# EAGLE schematic calculator_15-Digit (EAGLE 6.6.0)

## Sheet 1 of 4
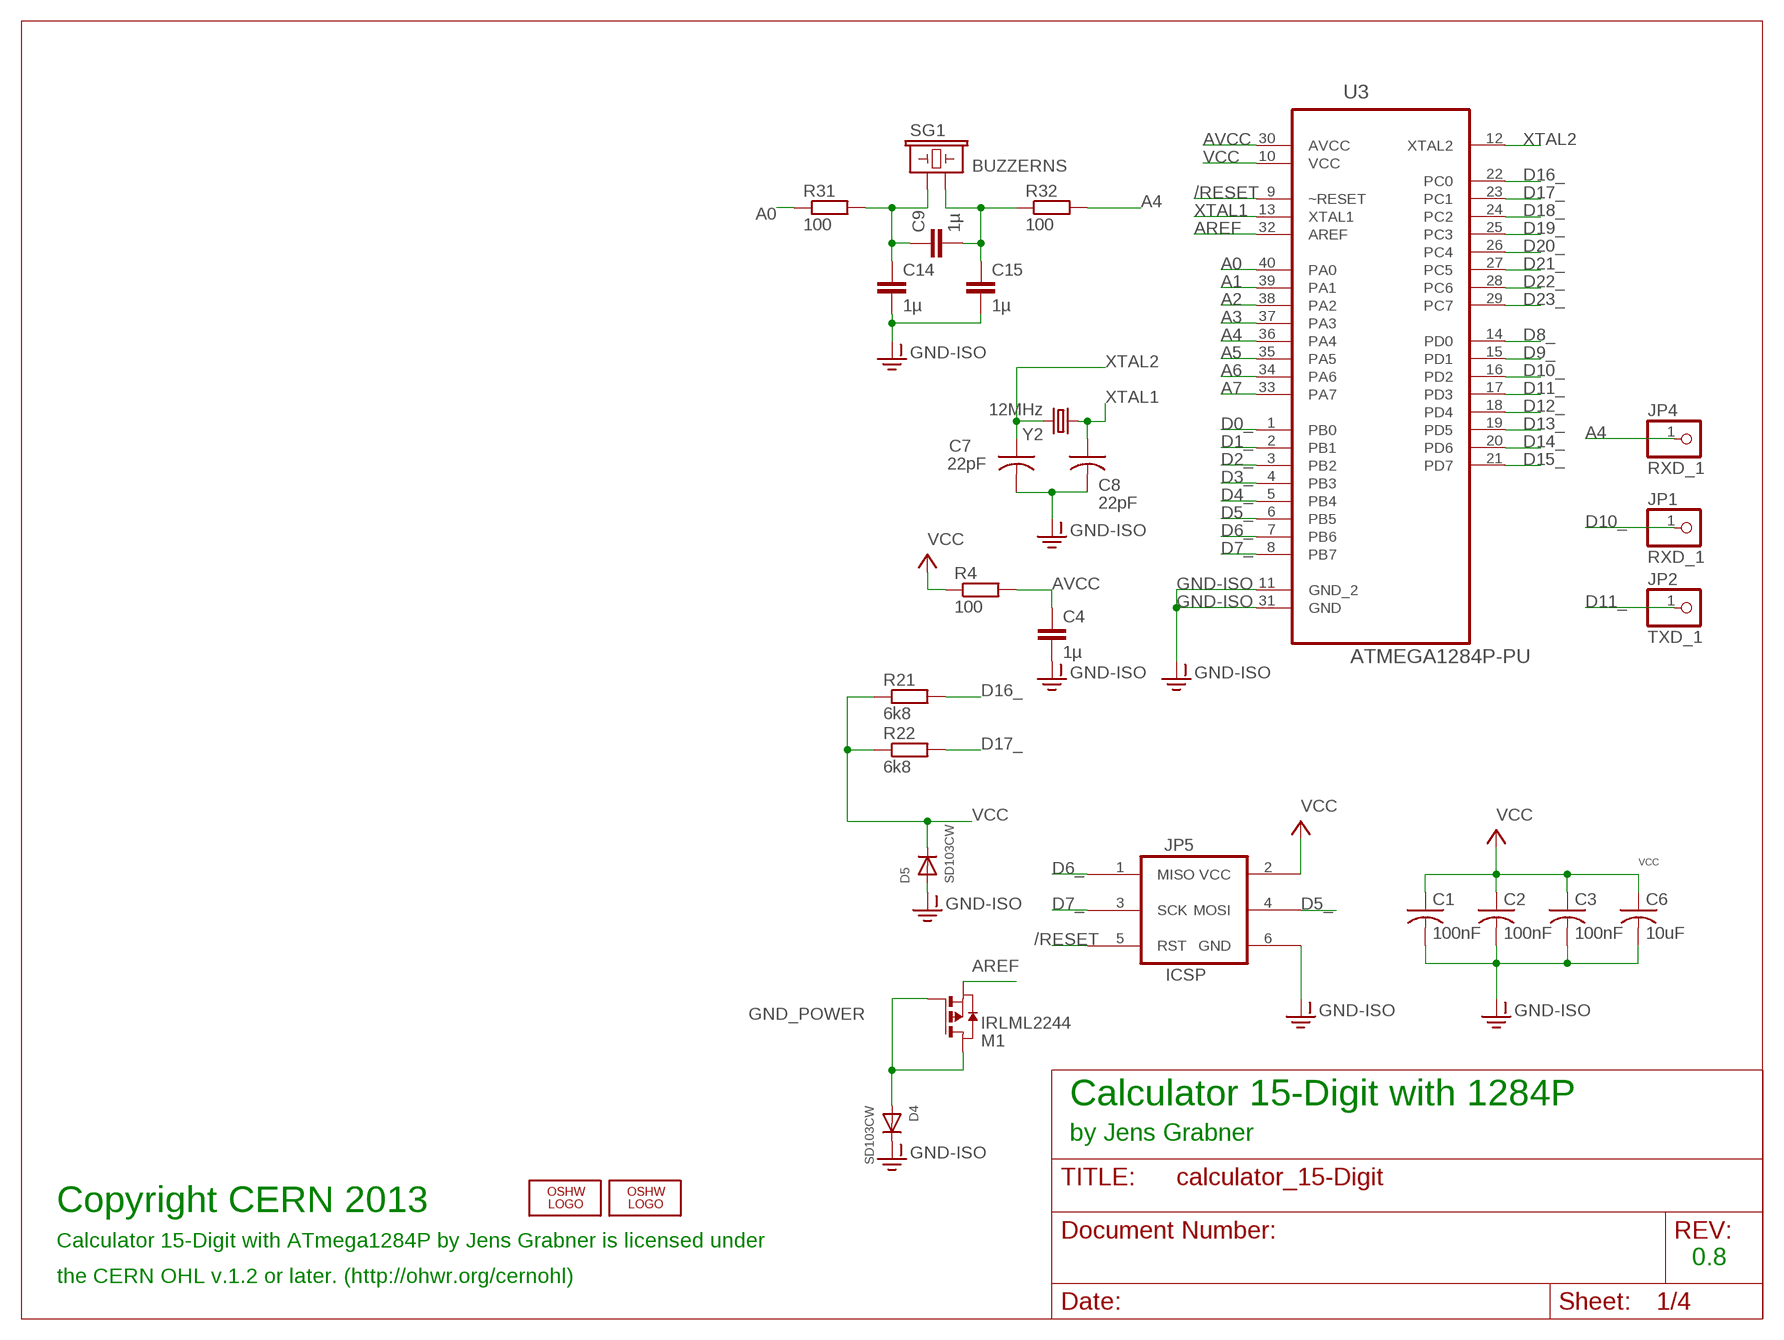
[diagram p0: schematic, sheet 1]

### Parts
C1  100nF  C-US025_050-025X075  [C025_050-025X075]
C2  100nF  C-US025_050-025X075  [C025_050-025X075]
C3  100nF  C-US025_050-025X075  [C025_050-025X075]
C4  1µ  C-EU025_050-025X075  [C025_050-025X075]
C6  10uF  C-US025_050-025X075  [C025_050-025X075]
C7  22pF  C-US025-024X044  [C025-024X044]
C8  22pF  C-US025-024X044  [C025-024X044]
C9  1µ  C-EU025_050-025X075  [C025_050-025X075]
C14  1µ  C-EU025_050-025X075  [C025_050-025X075]
C15  1µ  C-EU025_050-025X075  [C025_050-025X075]
D4  SD103CW  DIODESMA  [SMADIODE]
D5  SD103CW  DIODESMA  [SMADIODE]
JP1  RXD_1  PINHD-1X1CB  [1X01-CLEANBIG]
JP2  TXD_1  PINHD-1X1CB  [1X01-CLEANBIG]
JP4  RXD_1  PINHD-1X1CB  [1X01-CLEANBIG]
JP5  ICSP  AVR_SPI_PRG_62X3_LOCK  [2X3_LOCK]
LOGO1  OSHW_LOGO_8MILX0150-NT  [OSHW_8X150_NOTEXT]
LOGO2  OSHW_LOGO_6MILX0100-NT  [OSHW_6X100_NOTEXT]
M1  IRLML2244  IRLML6402  [SOT-23]
R4  100  R-EU_0204/7  [0204/7]
R21  6k8  R-EU_0204/7  [0204/7]
R22  6k8  R-EU_0204/7  [0204/7]
R31  100  R-EU_0204/7  [0204/7]
R32  100  R-EU_0204/7  [0204/7]
SG1  BUZZERNS  [BUZZER-12MM-NS]
U3  ATMEGA1284P-PU  [DIP254P1524X483-40]
Y2  12MHz  CRYSTALHC49UV  [HC49U-V]

### Nets
/RESET: JP5.5(RST) U3.9(~RESET) ; also sheet 4
A0: R31.1 U3.40(PA0)
A1: U3.39(PA1) ; also sheet 2
A2: U3.38(PA2) ; also sheet 2
A3: U3.37(PA3) ; also sheet 2
A4: JP4.1 R32.2 U3.36(PA4)
A5: U3.35(PA5) ; also sheet 2
A6: U3.34(PA6) ; also sheet 2
A7: U3.33(PA7) ; also sheet 2
AREF: M1.2(S) U3.32(AREF) ; also sheet 4
AVCC: C4.1 R4.2 U3.30(AVCC)
D0_: U3.1(PB0) ; also sheet 3
D1_: U3.2(PB1) ; also sheet 3
D2_: U3.3(PB2)
D3_: U3.4(PB3) ; also sheet 3
D4_: U3.5(PB4)
D5_: JP5.4(MOSI) U3.6(PB5)
D6_: JP5.1(MISO) U3.7(PB6) ; also sheet 3
D7_: JP5.3(SCK) U3.8(PB7) ; also sheet 3
D8_: U3.14(PD0) ; also sheet 4
D9_: U3.15(PD1) ; also sheet 4
D10_: JP1.1 U3.16(PD2) ; also sheet 3
D11_: JP2.1 U3.17(PD3) ; also sheet 3
D12_: U3.18(PD4) ; also sheet 2
D13_: U3.19(PD5) ; also sheet 3
D14_: U3.20(PD6) ; also sheet 3
D15_: U3.21(PD7) ; also sheet 3
D16_: R21.2 U3.22(PC0)
D17_: R22.2 U3.23(PC1)
D18_: U3.24(PC2) ; also sheet 4
D19_: U3.25(PC3) ; also sheet 3
D20_: U3.26(PC4) ; also sheet 3
D21_: U3.27(PC5) ; also sheet 3
D22_: U3.28(PC6) ; also sheet 3
D23_: U3.29(PC7) ; also sheet 3
GND-ISO: C1.2 C2.2 C3.2 C4.2 C6.2 C7.2 C8.2 C14.2 C15.2 D4.C D5.A JP5.6(GND) U3.11(GND_2) U3.31(GND) ; also sheet 2,4
GND_POWER: D4.A M1.1(G) M1.3(D)
N$10: C9.2 C15.1 R32.1 SG1.-
N$23: C9.1 C14.1 R31.2 SG1.+
VCC: C1.1 C2.1 C3.1 C6.1 D5.C JP5.2(VCC) R4.1 R21.1 R22.1 U3.10(VCC) ; also sheet 4
XTAL1: C8.1 U3.13(XTAL1) Y2.1
XTAL2: C7.1 U3.12(XTAL2) Y2.2

### Notes on the sheet
- Calculator 15-Digit with 1284P
- by Jens Grabner
- Copyright CERN 2013
- Calculator 15-Digit with ATmega1284P by Jens Grabner is licensed under
- 0.8
- the CERN OHL v.1.2 or later. (http://ohwr.org/cernohl)

## Sheet 2 of 4
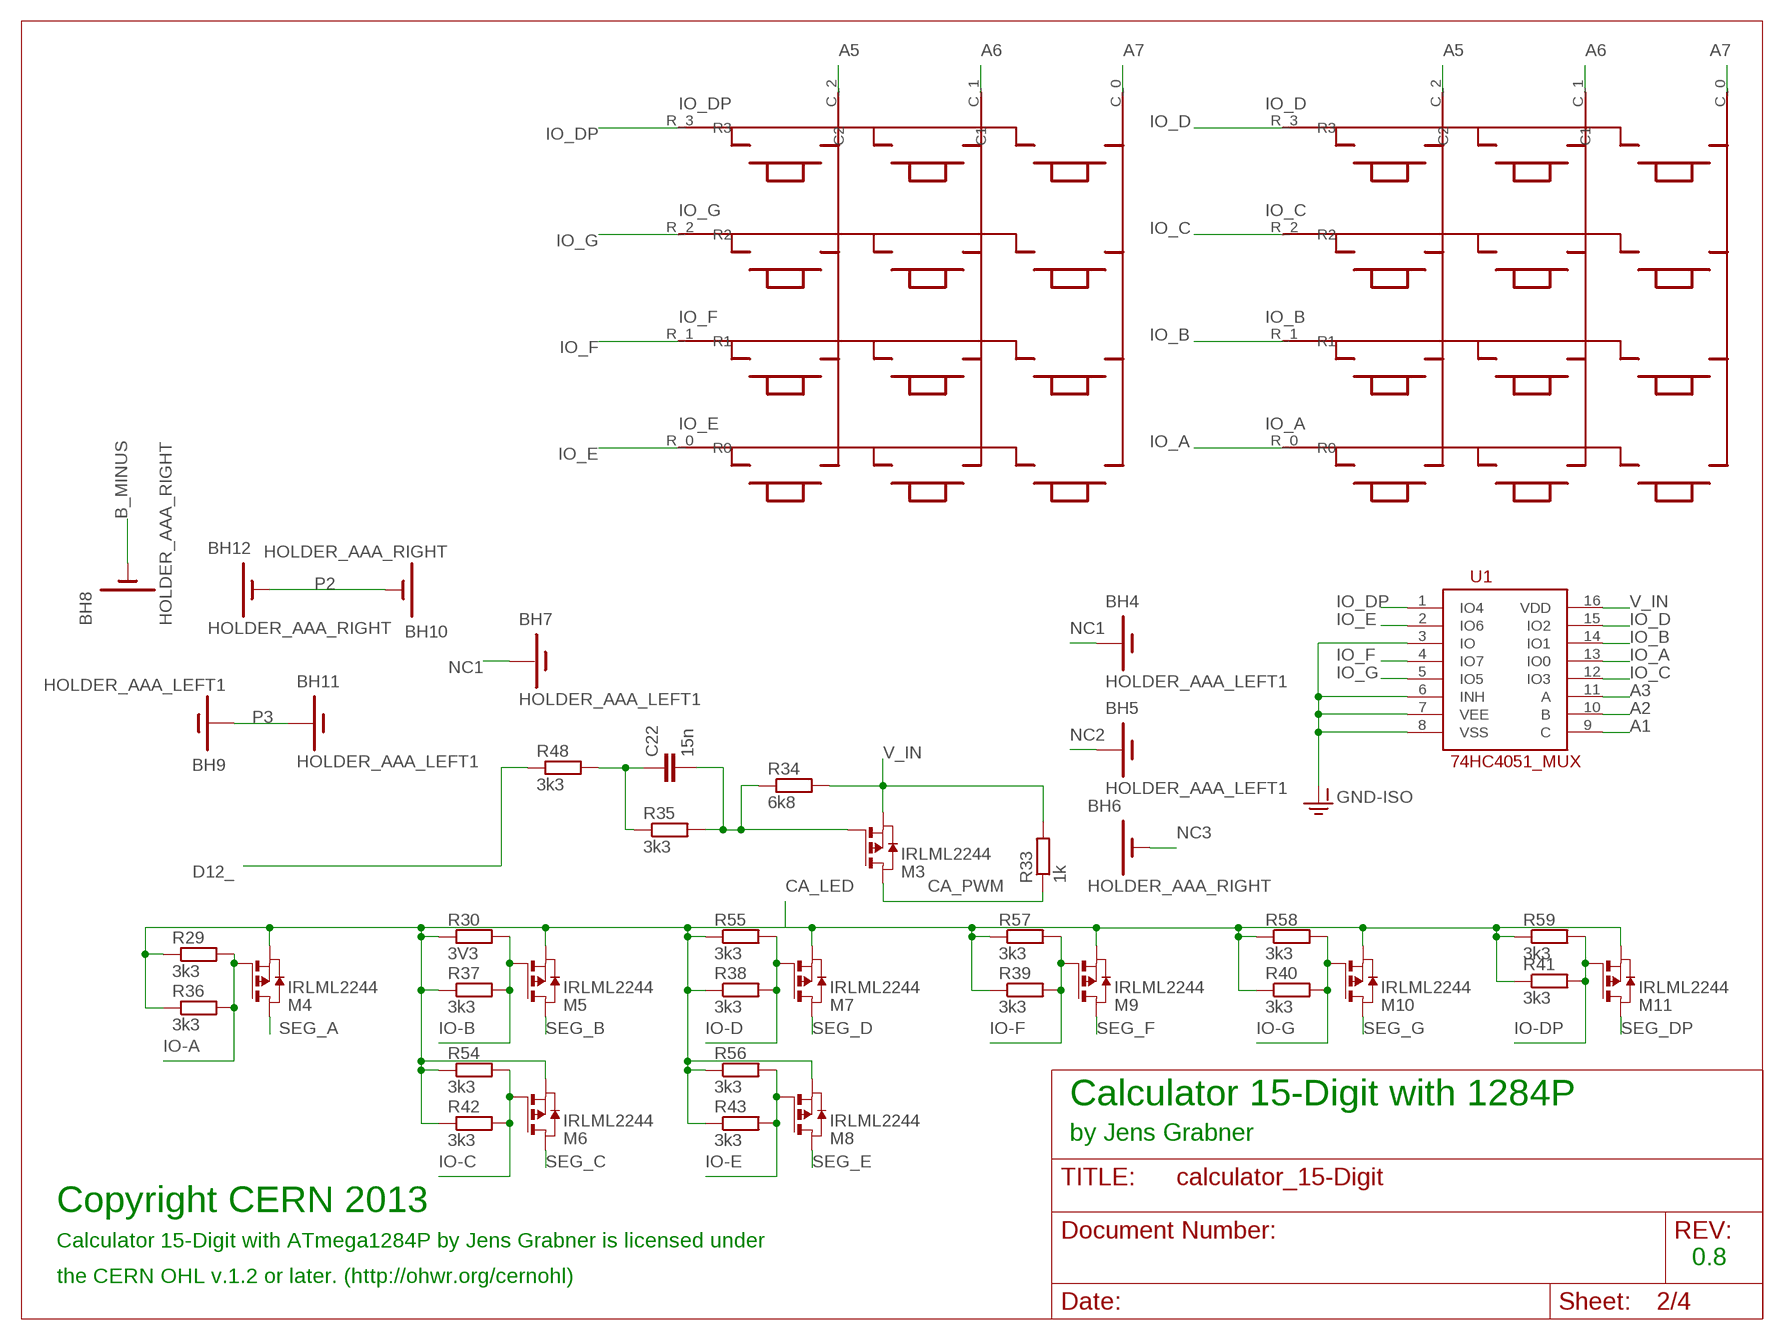
[diagram p1: schematic, sheet 2]

### Parts
BH4  HOLDER_AAA_LEFT1  [BATTERY-AAA-LEFT]
BH5  HOLDER_AAA_LEFT1  [BATTERY-AAA-LEFT]
BH6  HOLDER_AAA_RIGHT  [BATTERY-AAA-RIGHT]
BH7  HOLDER_AAA_LEFT1  [BATTERY-AAA-LEFT]
BH8  HOLDER_AAA_RIGHT  [BATTERY-AAA-RIGHT]
BH9  HOLDER_AAA_LEFT1  [BATTERY-AAA-LEFT]
BH10  HOLDER_AAA_RIGHT  [BATTERY-AAA-RIGHT]
BH11  HOLDER_AAA_LEFT1  [BATTERY-AAA-LEFT]
BH12  HOLDER_AAA_RIGHT  [BATTERY-AAA-RIGHT]
C22  15n  C-EUC1206K  [C1206K]
KP1  KEYPAD  [KEYPAD]
KP2  KEYPAD  [KEYPAD]
M3  IRLML2244  IRLML6402  [SOT-23]
M4  IRLML2244  IRLML6402  [SOT-23]
M5  IRLML2244  IRLML6402  [SOT-23]
M6  IRLML2244  IRLML6402  [SOT-23]
M7  IRLML2244  IRLML6402  [SOT-23]
M8  IRLML2244  IRLML6402  [SOT-23]
M9  IRLML2244  IRLML6402  [SOT-23]
M10  IRLML2244  IRLML6402  [SOT-23]
M11  IRLML2244  IRLML6402  [SOT-23]
R29  3k3  R-EU_0204/5  [0204/5]
R30  3V3  R-EU_0204/5  [0204/5]
R33  1k  R-EU_0204/7  [0204/7]
R34  6k8  R-EU_0204/7  [0204/7]
R35  3k3  R-EU_0204/7  [0204/7]
R36  3k3  R-EU_R1206  [R1206]
R37  3k3  R-EU_R1206  [R1206]
R38  3k3  R-EU_R1206  [R1206]
R39  3k3  R-EU_R1206  [R1206]
R40  3k3  R-EU_R1206  [R1206]
R41  3k3  R-EU_R1206  [R1206]
R42  3k3  R-EU_R1206  [R1206]
R43  3k3  R-EU_R1206  [R1206]
R48  3k3  R-EU_0204/7  [0204/7]
R54  3k3  R-EU_0204/5  [0204/5]
R55  3k3  R-EU_0204/5  [0204/5]
R56  3k3  R-EU_0204/5  [0204/5]
R57  3k3  R-EU_0204/5  [0204/5]
R58  3k3  R-EU_0204/5  [0204/5]
R59  3k3  R-EU_0204/5  [0204/5]
U1  74HC4051_MUX  [SO16]

### Nets
A1: U1.9(C) ; also sheet 1
A2: U1.10(B) ; also sheet 1
A3: U1.11(A) ; also sheet 1
A5: KP1.C_2(C2) KP2.C_2(C2) ; also sheet 1
A6: KP1.C_1(C1) KP2.C_1(C1) ; also sheet 1
A7: KP1.C_0(C0) KP2.C_0(C0) ; also sheet 1
A8: C22.1 R35.1 R48.2
B_MINUS: BH8.M1(-) BH8.M2(-) BH8.M3(-) BH8.M4(-) ; also sheet 4
CA_LED: M4.2(S) M5.2(S) M6.2(S) M7.2(S) M8.2(S) M9.2(S) M10.2(S) M11.2(S) R29.1 R30.1 R36.1 R37.1 R38.1 R39.1 R40.1 R41.1 R42.1 R43.1 R54.1 R55.1 R56.1 R57.1 R58.1 R59.1 ; also sheet 3
CA_PWM: M3.3(D) R33.1 ; also sheet 3
D12_: R48.1 ; also sheet 1
GND1: C22.2
GND-ISO: U1.3(IO) U1.6(INH) U1.7(VEE) U1.8(VSS) ; also sheet 1,4
IO-A: M4.1(G) R29.2 R36.2 ; also sheet 3
IO-B: M5.1(G) R30.2 R37.2 ; also sheet 3
IO-C: M6.1(G) R42.2 R54.2 ; also sheet 3
IO-D: M7.1(G) R38.2 R55.2 ; also sheet 3
IO-DP: M11.1(G) R41.2 R59.2 ; also sheet 3
IO-E: M8.1(G) R43.2 R56.2 ; also sheet 3
IO-F: M9.1(G) R39.2 R57.2 ; also sheet 3
IO-G: M10.1(G) R40.2 R58.2 ; also sheet 3
IO_A: KP2.R_0(R0) U1.13(IO0) ; also sheet 3
IO_B: KP2.R_1(R1) U1.14(IO1) ; also sheet 3
IO_C: KP2.R_2(R2) U1.12(IO3) ; also sheet 3
IO_D: KP2.R_3(R3) U1.15(IO2) ; also sheet 3
IO_DP: KP1.R_3(R3) U1.1(IO4) ; also sheet 3
IO_E: KP1.R_0(R0) U1.2(IO6) ; also sheet 3
IO_F: KP1.R_1(R1) U1.4(IO7) ; also sheet 3
IO_G: KP1.R_2(R2) U1.5(IO5) ; also sheet 3
N$1: M3.1(G) R34.1 R35.2
NC1: BH4.P1(+) BH4.P2(+) BH4.P3(+) BH4.P4(+) BH7.P1(+) BH7.P2(+) BH7.P3(+) BH7.P4(+)
NC2: BH5.P1(+) BH5.P2(+) BH5.P3(+) BH5.P4(+)
NC3: BH6.M1(-) BH6.M2(-) BH6.M3(-) BH6.M4(-)
P2: BH10.M1(-) BH10.M2(-) BH10.M3(-) BH10.M4(-) BH12.M1(-) BH12.M2(-) BH12.M3(-) BH12.M4(-)
P3: BH9.P1(+) BH9.P2(+) BH9.P3(+) BH9.P4(+) BH11.P1(+) BH11.P2(+) BH11.P3(+) BH11.P4(+)
SEG_A: M4.3(D) ; also sheet 3
SEG_B: M5.3(D) ; also sheet 3
SEG_C: M6.3(D) ; also sheet 3
SEG_D: M7.3(D) ; also sheet 3
SEG_DP: M11.3(D) ; also sheet 3
SEG_E: M8.3(D) ; also sheet 3
SEG_F: M9.3(D) ; also sheet 3
SEG_G: M10.3(D) ; also sheet 3
V_IN: M3.2(S) R33.2 R34.2 U1.16(VDD) ; also sheet 4

### Notes on the sheet
- Calculator 15-Digit with 1284P
- by Jens Grabner
- Copyright CERN 2013
- Calculator 15-Digit with ATmega1284P by Jens Grabner is licensed under
- 0.8
- the CERN OHL v.1.2 or later. (http://ohwr.org/cernohl)

## Sheet 3 of 4
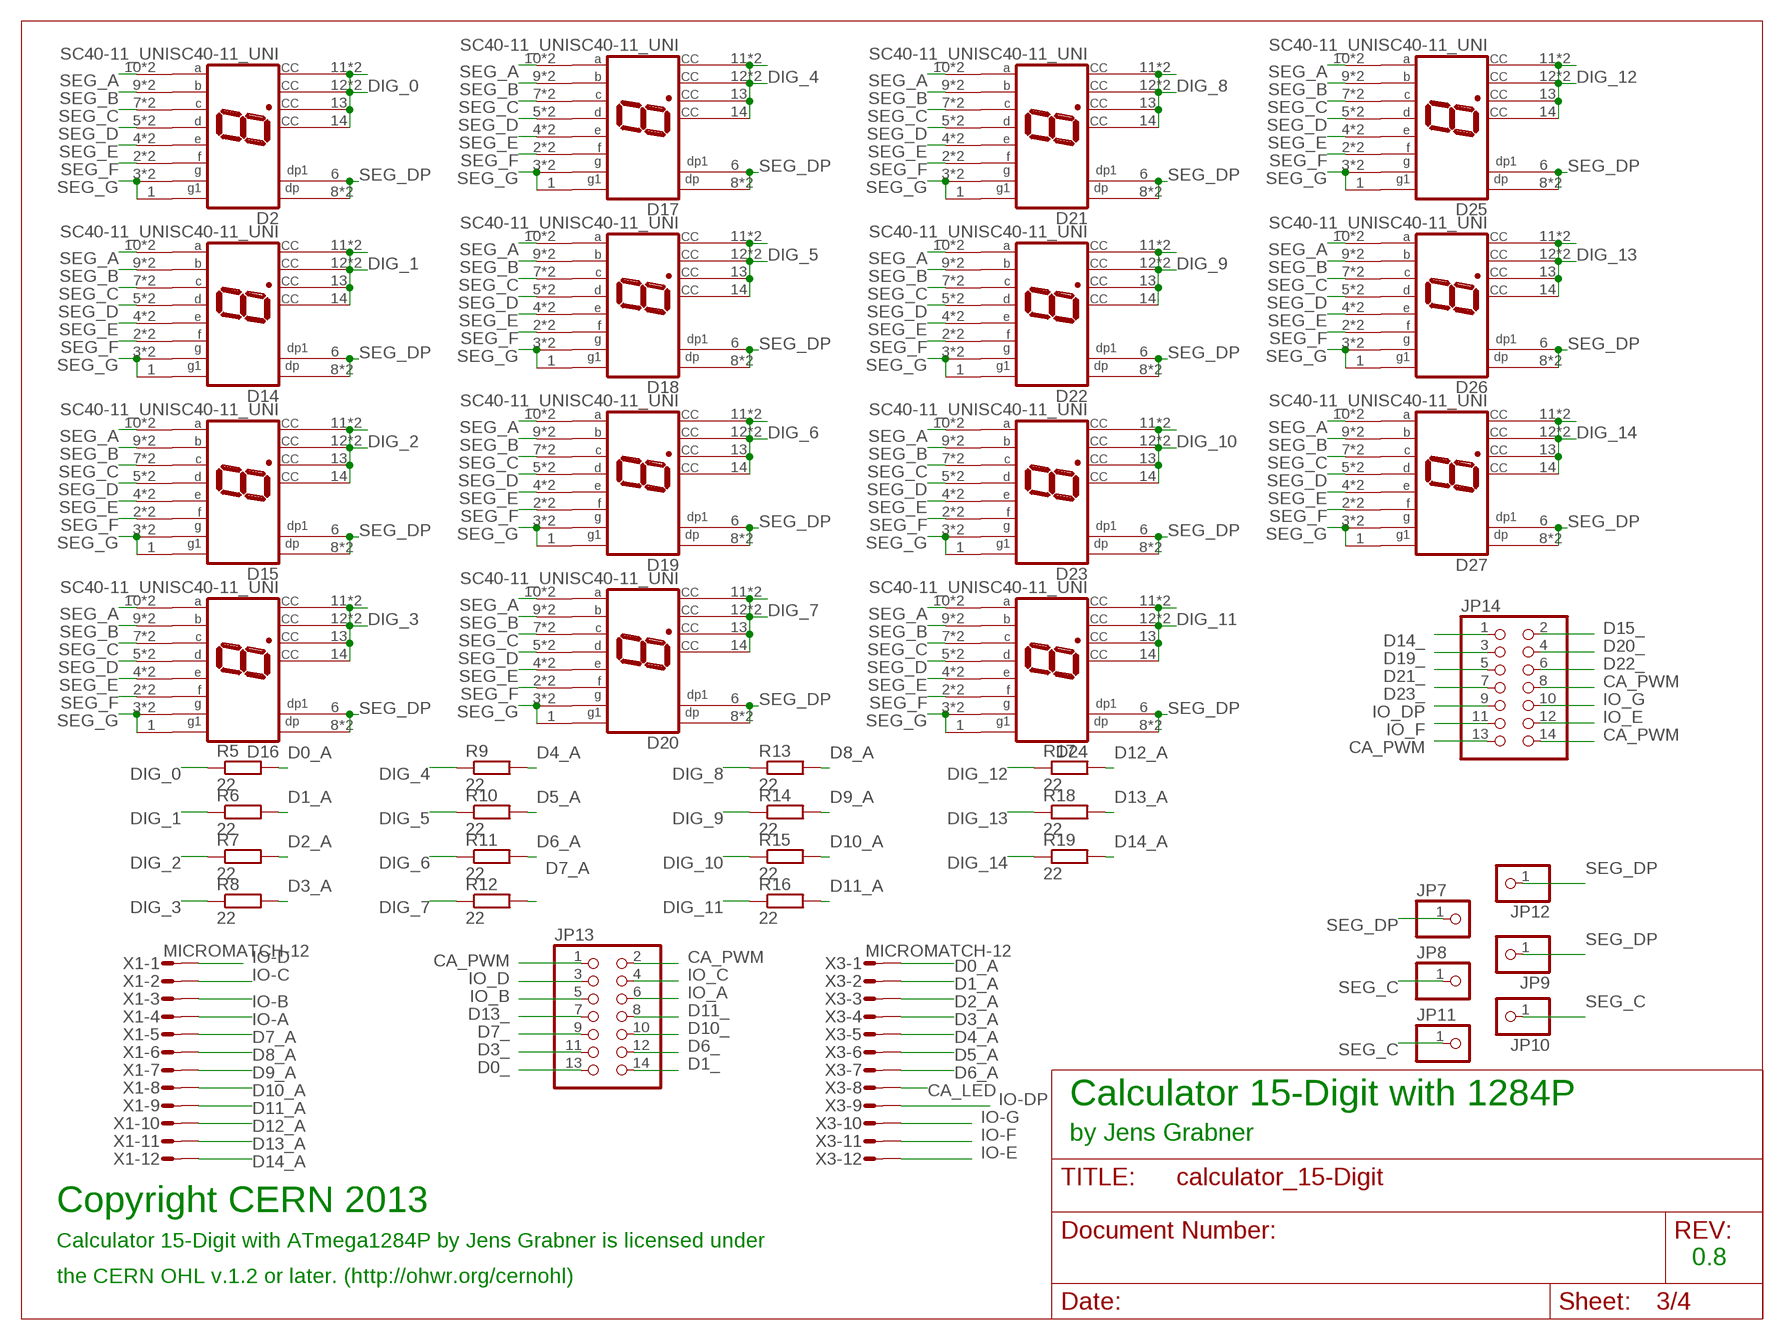
[diagram p2: schematic, sheet 3]

### Parts
D2  SC40-11_UNISC40-11_UNI  [10MM_UNI]
D14  SC40-11_UNISC40-11_UNI  [10MM_UNI]
D15  SC40-11_UNISC40-11_UNI  [10MM_UNI]
D16  SC40-11_UNISC40-11_UNI  [10MM_UNI]
D17  SC40-11_UNISC40-11_UNI  [10MM_UNI]
D18  SC40-11_UNISC40-11_UNI  [10MM_UNI]
D19  SC40-11_UNISC40-11_UNI  [10MM_UNI]
D20  SC40-11_UNISC40-11_UNI  [10MM_UNI]
D21  SC40-11_UNISC40-11_UNI  [10MM_UNI]
D22  SC40-11_UNISC40-11_UNI  [10MM_UNI]
D23  SC40-11_UNISC40-11_UNI  [10MM_UNI]
D24  SC40-11_UNISC40-11_UNI  [10MM_UNI]
D25  SC40-11_UNISC40-11_UNI  [10MM_UNI]
D26  SC40-11_UNISC40-11_UNI  [10MM_UNI]
D27  SC40-11_UNISC40-11_UNI  [10MM_UNI]
JP7  PINHD-1X1  [1X01]
JP8  PINHD-1X1  [1X01]
JP9  PINHD-1X1  [1X01]
JP10  PINHD-1X1  [1X01]
JP11  PINHD-1X1  [1X01]
JP12  PINHD-1X1  [1X01]
JP13  PINHD-2X7  [2X07]
JP14  PINHD-2X7  [2X07]
R5  22  R-EU_R1210  [R1210]
R6  22  R-EU_R1210  [R1210]
R7  22  R-EU_R1210  [R1210]
R8  22  R-EU_R1210  [R1210]
R9  22  R-EU_R1210  [R1210]
R10  22  R-EU_R1210  [R1210]
R11  22  R-EU_R1210  [R1210]
R12  22  R-EU_R1210  [R1210]
R13  22  R-EU_R1210  [R1210]
R14  22  R-EU_R1210  [R1210]
R15  22  R-EU_R1210  [R1210]
R16  22  R-EU_R1210  [R1210]
R17  22  R-EU_R1210  [R1210]
R18  22  R-EU_R1210  [R1210]
R19  22  R-EU_R1210  [R1210]
X1  MICROMATCH-12  [MICROMATCH-12]
X3  MICROMATCH-12  [MICROMATCH-12]

### Nets
CA_LED: X3.8 ; also sheet 2
CA_PWM: JP13.1 JP13.2 JP14.8 JP14.13 JP14.14 ; also sheet 2
D0_: JP13.13 ; also sheet 1
D0_A: R5.2 X3.1
D1_: JP13.14 ; also sheet 1
D1_A: R6.2 X3.2
D2_A: R7.2 X3.3
D3_: JP13.11 ; also sheet 1
D3_A: R8.2 X3.4
D4_A: R9.2 X3.5
D5_A: R10.2 X3.6
D6_: JP13.12 ; also sheet 1
D6_A: R11.2 X3.7
D7_: JP13.9 ; also sheet 1
D7_A: R12.2 X1.5
D8_A: R13.2 X1.6
D9_A: R14.2 X1.7
D10_: JP13.10 ; also sheet 1
D10_A: R15.2 X1.8
D11_: JP13.8 ; also sheet 1
D11_A: R16.2 X1.9
D12_A: R17.2 X1.10
D13_: JP13.7 ; also sheet 1
D13_A: R18.2 X1.11
D14_: JP14.1 ; also sheet 1
D14_A: R19.2 X1.12
D15_: JP14.2 ; also sheet 1
D19_: JP14.3 ; also sheet 1
D20_: JP14.4 ; also sheet 1
D21_: JP14.5 ; also sheet 1
D22_: JP14.6 ; also sheet 1
D23_: JP14.7 ; also sheet 1
DIG_0: D2.11(CC1) D2.12(CC2) D2.13(CC3) D2.14(CC4) D2.23(CC1) D2.28(CC2) R5.1
DIG_1: D14.11(CC1) D14.12(CC2) D14.13(CC3) D14.14(CC4) D14.23(CC1) D14.28(CC2) R6.1
DIG_2: D15.11(CC1) D15.12(CC2) D15.13(CC3) D15.14(CC4) D15.23(CC1) D15.28(CC2) R7.1
DIG_3: D16.11(CC1) D16.12(CC2) D16.13(CC3) D16.14(CC4) D16.23(CC1) D16.28(CC2) R8.1
DIG_4: D17.11(CC1) D17.12(CC2) D17.13(CC3) D17.14(CC4) D17.23(CC1) D17.28(CC2) R9.1
DIG_5: D18.11(CC1) D18.12(CC2) D18.13(CC3) D18.14(CC4) D18.23(CC1) D18.28(CC2) R10.1
DIG_6: D19.11(CC1) D19.12(CC2) D19.13(CC3) D19.14(CC4) D19.23(CC1) D19.28(CC2) R11.1
DIG_7: D20.11(CC1) D20.12(CC2) D20.13(CC3) D20.14(CC4) D20.23(CC1) D20.28(CC2) R12.1
DIG_8: D21.11(CC1) D21.12(CC2) D21.13(CC3) D21.14(CC4) D21.23(CC1) D21.28(CC2) R13.1
DIG_9: D22.11(CC1) D22.12(CC2) D22.13(CC3) D22.14(CC4) D22.23(CC1) D22.28(CC2) R14.1
DIG_10: D23.11(CC1) D23.12(CC2) D23.13(CC3) D23.14(CC4) D23.23(CC1) D23.28(CC2) R15.1
DIG_11: D24.11(CC1) D24.12(CC2) D24.13(CC3) D24.14(CC4) D24.23(CC1) D24.28(CC2) R16.1
DIG_12: D25.11(CC1) D25.12(CC2) D25.13(CC3) D25.14(CC4) D25.23(CC1) D25.28(CC2) R17.1
DIG_13: D26.11(CC1) D26.12(CC2) D26.13(CC3) D26.14(CC4) D26.23(CC1) D26.28(CC2) R18.1
DIG_14: D27.11(CC1) D27.12(CC2) D27.13(CC3) D27.14(CC4) D27.23(CC1) D27.28(CC2) R19.1
IO-A: X1.4 ; also sheet 2
IO-B: X1.3 ; also sheet 2
IO-C: X1.2 ; also sheet 2
IO-D: X1.1 ; also sheet 2
IO-DP: X3.9 ; also sheet 2
IO-E: X3.12 ; also sheet 2
IO-F: X3.11 ; also sheet 2
IO-G: X3.10 ; also sheet 2
IO_A: JP13.6 ; also sheet 2
IO_B: JP13.5 ; also sheet 2
IO_C: JP13.4 ; also sheet 2
IO_D: JP13.3 ; also sheet 2
IO_DP: JP14.9 ; also sheet 2
IO_E: JP14.12 ; also sheet 2
IO_F: JP14.11 ; also sheet 2
IO_G: JP14.10 ; also sheet 2
SEG_A: D2.10(A) D2.27(A) D14.10(A) D14.27(A) D15.10(A) D15.27(A) D16.10(A) D16.27(A) D17.10(A) D17.27(A) D18.10(A) D18.27(A) D19.10(A) D19.27(A) D20.10(A) D20.27(A) D21.10(A) D21.27(A) D22.10(A) D22.27(A) D23.10(A) D23.27(A) D24.10(A) D24.27(A) D25.10(A) D25.27(A) D26.10(A) D26.27(A) D27.10(A) D27.27(A) ; also sheet 2
SEG_B: D2.9(B) D2.26(B) D14.9(B) D14.26(B) D15.9(B) D15.26(B) D16.9(B) D16.26(B) D17.9(B) D17.26(B) D18.9(B) D18.26(B) D19.9(B) D19.26(B) D20.9(B) D20.26(B) D21.9(B) D21.26(B) D22.9(B) D22.26(B) D23.9(B) D23.26(B) D24.9(B) D24.26(B) D25.9(B) D25.26(B) D26.9(B) D26.26(B) D27.9(B) D27.26(B) ; also sheet 2
SEG_C: D2.7(C) D2.24(C) D14.7(C) D14.24(C) D15.7(C) D15.24(C) D16.7(C) D16.24(C) D17.7(C) D17.24(C) D18.7(C) D18.24(C) D19.7(C) D19.24(C) D20.7(C) D20.24(C) D21.7(C) D21.24(C) D22.7(C) D22.24(C) D23.7(C) D23.24(C) D24.7(C) D24.24(C) D25.7(C) D25.24(C) D26.7(C) D26.24(C) D27.7(C) D27.24(C) JP8.1 JP10.1 JP11.1 ; also sheet 2
SEG_D: D2.5(D) D2.22(D) D14.5(D) D14.22(D) D15.5(D) D15.22(D) D16.5(D) D16.22(D) D17.5(D) D17.22(D) D18.5(D) D18.22(D) D19.5(D) D19.22(D) D20.5(D) D20.22(D) D21.5(D) D21.22(D) D22.5(D) D22.22(D) D23.5(D) D23.22(D) D24.5(D) D24.22(D) D25.5(D) D25.22(D) D26.5(D) D26.22(D) D27.5(D) D27.22(D) ; also sheet 2
SEG_DP: D2.6(DP1) D2.8(DP) D2.25(DP) D14.6(DP1) D14.8(DP) D14.25(DP) D15.6(DP1) D15.8(DP) D15.25(DP) D16.6(DP1) D16.8(DP) D16.25(DP) D17.6(DP1) D17.8(DP) D17.25(DP) D18.6(DP1) D18.8(DP) D18.25(DP) D19.6(DP1) D19.8(DP) D19.25(DP) D20.6(DP1) D20.8(DP) D20.25(DP) D21.6(DP1) D21.8(DP) D21.25(DP) D22.6(DP1) D22.8(DP) D22.25(DP) D23.6(DP1) D23.8(DP) D23.25(DP) D24.6(DP1) D24.8(DP) D24.25(DP) D25.6(DP1) D25.8(DP) D25.25(DP) D26.6(DP1) D26.8(DP) D26.25(DP) D27.6(DP1) D27.8(DP) D27.25(DP) JP7.1 JP9.1 JP12.1 ; also sheet 2
SEG_E: D2.4(E) D2.21(E) D14.4(E) D14.21(E) D15.4(E) D15.21(E) D16.4(E) D16.21(E) D17.4(E) D17.21(E) D18.4(E) D18.21(E) D19.4(E) D19.21(E) D20.4(E) D20.21(E) D21.4(E) D21.21(E) D22.4(E) D22.21(E) D23.4(E) D23.21(E) D24.4(E) D24.21(E) D25.4(E) D25.21(E) D26.4(E) D26.21(E) D27.4(E) D27.21(E) ; also sheet 2
SEG_F: D2.2(F) D2.29(F) D14.2(F) D14.29(F) D15.2(F) D15.29(F) D16.2(F) D16.29(F) D17.2(F) D17.29(F) D18.2(F) D18.29(F) D19.2(F) D19.29(F) D20.2(F) D20.29(F) D21.2(F) D21.29(F) D22.2(F) D22.29(F) D23.2(F) D23.29(F) D24.2(F) D24.29(F) D25.2(F) D25.29(F) D26.2(F) D26.29(F) D27.2(F) D27.29(F) ; also sheet 2
SEG_G: D2.1(G1) D2.3(G) D2.30(G) D14.1(G1) D14.3(G) D14.30(G) D15.1(G1) D15.3(G) D15.30(G) D16.1(G1) D16.3(G) D16.30(G) D17.1(G1) D17.3(G) D17.30(G) D18.1(G1) D18.3(G) D18.30(G) D19.1(G1) D19.3(G) D19.30(G) D20.1(G1) D20.3(G) D20.30(G) D21.1(G1) D21.3(G) D21.30(G) D22.1(G1) D22.3(G) D22.30(G) D23.1(G1) D23.3(G) D23.30(G) D24.1(G1) D24.3(G) D24.30(G) D25.1(G1) D25.3(G) D25.30(G) D26.1(G1) D26.3(G) D26.30(G) D27.1(G1) D27.3(G) D27.30(G) ; also sheet 2

### Notes on the sheet
- Calculator 15-Digit with 1284P
- by Jens Grabner
- Copyright CERN 2013
- Calculator 15-Digit with ATmega1284P by Jens Grabner is licensed under
- 0.8
- the CERN OHL v.1.2 or later. (http://ohwr.org/cernohl)

## Sheet 4 of 4
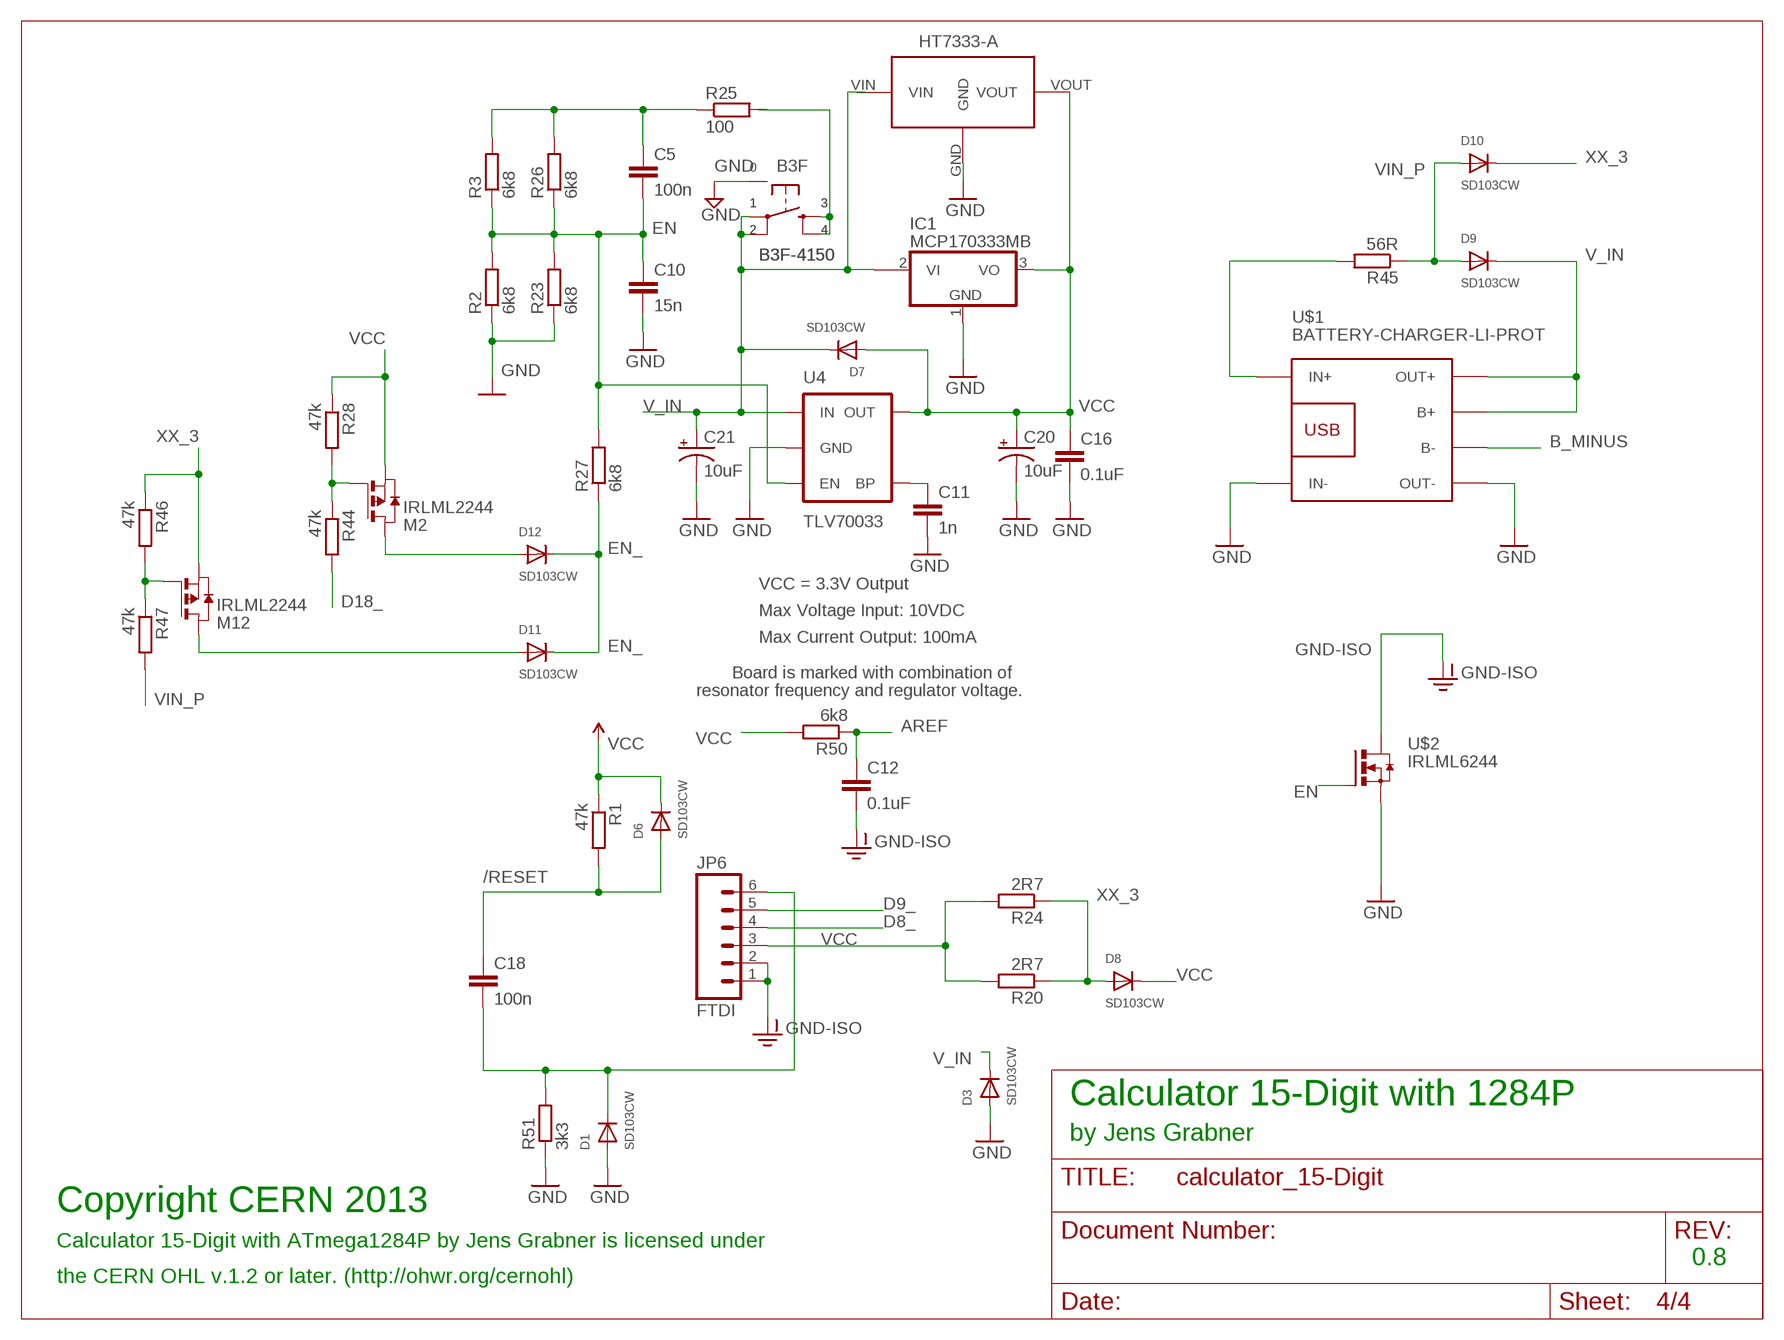
[diagram p3: schematic, sheet 4]

### Parts
C5  100n  C-EUC1206K  [C1206K]
C10  15n  C-EUC1206K  [C1206K]
C11  1n  CAP0805  [0805]
C12  0.1uF  CAP0805  [0805]
C16  0.1uF  CAP0805  [0805]
C18  100n  C-EU025_050-025X075  [C025_050-025X075]
C20  10uF  CAP_POL1206  [EIA3216]
C21  10uF  CAP_POL1206  [EIA3216]
D1  SD103CW  DIODESMA  [SMADIODE]
D3  SD103CW  DIODESMA  [SMADIODE]
D6  SD103CW  DIODESMA  [SMADIODE]
D7  SD103CW  DIODESMA  [SMADIODE]
D8  SD103CW  DIODESMA  [SMADIODE]
D9  SD103CW  DIODESMA  [SMADIODE]
D10  SD103CW  DIODESMA  [SMADIODE]
D11  SD103CW  DIODESMA  [SMADIODE]
D12  SD103CW  DIODESMA  [SMADIODE]
IC1  MCP170333MB  [SOT89]
JP6  FTDI  M06LOCK  [1X06_LOCK]
M2  IRLML2244  IRLML6402  [SOT-23]
M12  IRLML2244  IRLML6402  [SOT-23]
R1  47k  R-EU_0204/7  [0204/7]
R2  6k8  R-EU_0204/5  [0204/5]
R3  6k8  R-EU_R1206  [R1206]
R20  2R7  R-EU_0204/5  [0204/5]
R23  6k8  R-EU_R1206  [R1206]
R24  2R7  R-EU_R1206  [R1206]
R25  100  R-EU_0204/7  [0204/7]
R26  6k8  R-EU_0204/5  [0204/5]
R27  6k8  R-EU_R1206  [R1206]
R28  47k  R-EU_0204/7  [0204/7]
R44  47k  R-EU_0204/7  [0204/7]
R45  56R  R-EU_R1206  [R1206]
R46  47k  R-EU_0204/7  [0204/7]
R47  47k  R-EU_0204/7  [0204/7]
R50  6k8  R-EU_0204/7  [0204/7]
R51  3k3  R-EU_0204/7  [0204/7]
S3  B3F-4150  TACTILE_SWITCHTACTILE_SWITCH_PTH-12MM  [TACTILE-PTH-12MM]
U4  TLV70033  V_REG_LDOSMD  [SOT23-5]
U$1  BATTERY-CHARGER-LI-PROT  [BATTERY-CHARGER-LI-PROT]
U$2  IRLML6244  IRLML2502  [MICRO3]
U$3  HT7333  [SOT89]

### Nets
/RESET: C18.1 D6.A R1.2 ; also sheet 1
A9: C5.1 R3.2 R25.1 R26.2
AREF: C12.1 R50.1 ; also sheet 1
B_MINUS: U$1.B- ; also sheet 2
CA_PWM1: D12.A M2.3(D)
CA_PWM2: D11.A M12.3(D)
D8_: JP6.4 ; also sheet 1
D9_: JP6.5 ; also sheet 1
D18_: R44.2 ; also sheet 1
EN: C5.2 C10.1 R2.2 R3.1 R23.2 R26.1 R27.2 U4.3(EN) U$2.1(G)
EN_: D11.C D12.C R27.1
GND: C10.2 C11.2 C16.2 C20.C(-) C21.C(-) D1.A D3.A IC1.1(GND) R2.1 R23.1 R51.1 S3.P$15 U4.2(GND) U$1.IN- U$1.OUT- U$3.GND
GND-ISO: C12.2 JP6.1 JP6.2 U$2.3(D) ; also sheet 1,2
N$2: U$2.2(S)
N$3: C11.1 U4.4(BP)
N$6: S3.P$3 S3.P$4 S3.P$13 S3.P$14 S3.P$23 S3.P$24
N$8: M2.1(G) R28.2 R44.1
N$9: M12.1(G) R46.2 R47.1
N$12: C18.2 D1.C JP6.6 R51.2
N$13: R45.2 U$1.IN+
V_IN: C21.A(+) D3.C D7.C D9.C IC1.2@1(VI1) S3.P$1 S3.P$2 S3.P$11 S3.P$12 S3.P$21 S3.P$22 U4.1(IN) U$1.B+ U$1.OUT+ ; also sheet 2
VCC: C16.1 C20.A(+) D6.C D7.A D8.C IC1.3(VO) JP6.3 M2.2(S) R1.1 R20.2 R24.2 R28.1 R50.2 U4.5(OUT) U$3.VOUT ; also sheet 1
VIN_P: D9.A D10.A R45.1 R47.2
XX_3: D8.A D10.C M12.2(S) R20.1 R24.1 R46.1
Unconnected: IC1.2(VI) R25.2 U$3.VIN

### Notes on the sheet
- HT7333-A
- VCC = 3.3V Output
- Max Voltage Input: 10VDC
- Max Current Output: 100mA
- Board is marked with combination of
- resonator frequency and regulator voltage.
- Calculator 15-Digit with 1284P
- by Jens Grabner
- Copyright CERN 2013
- Calculator 15-Digit with ATmega1284P by Jens Grabner is licensed under
- 0.8
- the CERN OHL v.1.2 or later. (http://ohwr.org/cernohl)

## Library data of the parts
BH4 BH5 BH7 BH9 BH11 = SparkFun-Electromechanical:HOLDER_AAA_LEFT
BH6 BH8 BH10 BH12 = SparkFun-Electromechanical:HOLDER_AAA_RIGHT
C1-C3 C6-C8 = _jc:C-US: CAPACITOR, American symbol
C4 C5 C9 C10 C14 C15 C18 C22 = rcl:C-EU: CAPACITOR, European symbol
C11 C12 C16 = SparkFun:CAP: Capacitor Standard 0603 ceramic capacitor, and 0.1" leaded capacitor.
C20 C21 = SparkFun:CAP_POL: Capacitor Polarized These are standard SMD and PTH capacitors. Normally 10uF, 47uF, and 100uF in electrolytic and tantalum varieties. Always verify the external diameter of the through hole cap, it varies with capacity, voltage, and manufacturer. The EIA devices should be standard.
D1 D3-D12 = BaseApp:DIODE
D2 D14-D27 = display-hp:SC40-11_UNI: SC40-11_UNI
IC1 = linear:MCP1703*: 250 mA, 16V, Low Quiescent Current LDO Regulator Source: http://ww1.microchip.com/downloads/en/DeviceDoc/22049b.pdf
JP1 JP2 JP4 JP7-JP12 = adafruit:PINHD-1X1: Pin header 1x1 for 0.1" spacing With round pins
JP5 = _jc:AVR_SPI_PRG_6: AVR ISP 6 Pin This is the reduced ISP connector for AVR programming. Common on Arduino. This footprint will take up less PCB space and can be used with a 10-pin to 6-pin adapter such as SKU: BOB-08508
JP6 = SparkFun:M06: Header 6 Standard 6-pin 0.1" header. Use with straight break away headers (SKU : PRT-00116), right angle break away headers (PRT-00553), swiss pins (PRT-00743), machine pins (PRT-00117), and female headers (PRT-00115). Molex polarized connector foot print use with SKU : PRT-08094 with associated crimp pins and housings. NOTES ON THE VARIANTS LOCK and LOCK_LONGPADS... This footprint was designed to help hold the alignment of a through-hole component (i.e. 6-pin header) while soldering it into place. You may notice that each hole has been shifted either up or down by 0.005 of an inch from it's more standard position (which is a perfectly straight line). This slight alteration caused the pins (the squares in the middle) to touch the edges of the holes. Because they are alternating, it causes a "brace" to hold the component in place. 0.005 has proven to be the perfect amount of "off-center" position when using our standard breakaway headers. Although looks a little odd when you look at the bare footprint, once you have a header in there, the alteration is very hard to notice. Also, if you push a header all the way into place, it is covered up entirely on the bottom side. This idea of altering the position of holes to aid alignment will be further integrated into the Sparkfun Library for other footprints. It can help hold any component with 3 or more connection pins.
JP13 JP14 = pinhead:PINHD-2X7: PIN HEADER
KP1 KP2 = KeyPad3x4:KEYPAD
LOGO1 = ohw-logo:OSHW_LOGO_8MIL
LOGO2 = ohw-logo:OSHW_LOGO_6MIL
M1-M12 = IRLML6402:IRLML6402
R1-R48 R50 R51 R54-R59 = rcl:R-EU_: RESISTOR, European symbol
S3 = SmartPrj:TACTILE_SWITCH: Momentary Switch Button commonly used for reset or general input.
SG1 = SparkFun-Electromechanical:BUZZER: Buzzer 12mm Spark Fun Electronics SKU : Comp-Buzzer
U1 = SparkFun-AnalogIC:74HC4051_MUX: 8:1 analog mux
U3 = Atmel_By_element14_Batch_1-00:ATMEGA1284P-PU: 8-bit Microcontroller with In-System Programmable Flash; MPN: ATMEGA1284P-PU; OC_FARNELL: 1715481; OC_NEWARK: 15R0264; PACKAGE: PDIP-40; SUPPLIER: Atmel
U4 = SparkFun:V_REG_LDO: Voltage Regulator LDO Standard 150mA LDO voltage regulator in SOT-23 layout. Micrel part MIC5205. BP (by-pass) pin is used to lower output noise with 470pF cap.
U$1 = diy-modules:BATTERY-CHARGER-LI-PROT: Lithium Battery 5V Charger with protection circuit More details available here: http://www.instructables.com/id/DIY-Lithium-ion-Battery-Charger/step4/TP4056-based-lithium-ion-battery-charger-module/ Click here to find device on ebay.com <http://www.ebay.com/sch/tp4056+charger+usb+protection>
U$2 = transistor-power:IRLML2502
U$3 = HT7333_SOT89:HT7333
X1 X3 = Con-amp-micromatch:MICROMATCH-12: MicroMaTch 12 8-215464-2 / 1-215464-2 Drawing Number C-215464 DDEController.pdf; MF: FARNELL; MPN: 8-215464-2; OC_FARNELL: 3784666; OC_NEWARK: 95H9857
Y2 = SparkFun-FreqCtrl:CRYSTAL: Various standard crystals. Proven footprints. Spark Fun Electronics SKU : COM-00534

## Net classes
0 default: clearance 0.205 mm
1 vcc: width 0.254 mm